# EAGLE schematic vac (EAGLE 8.5.1)
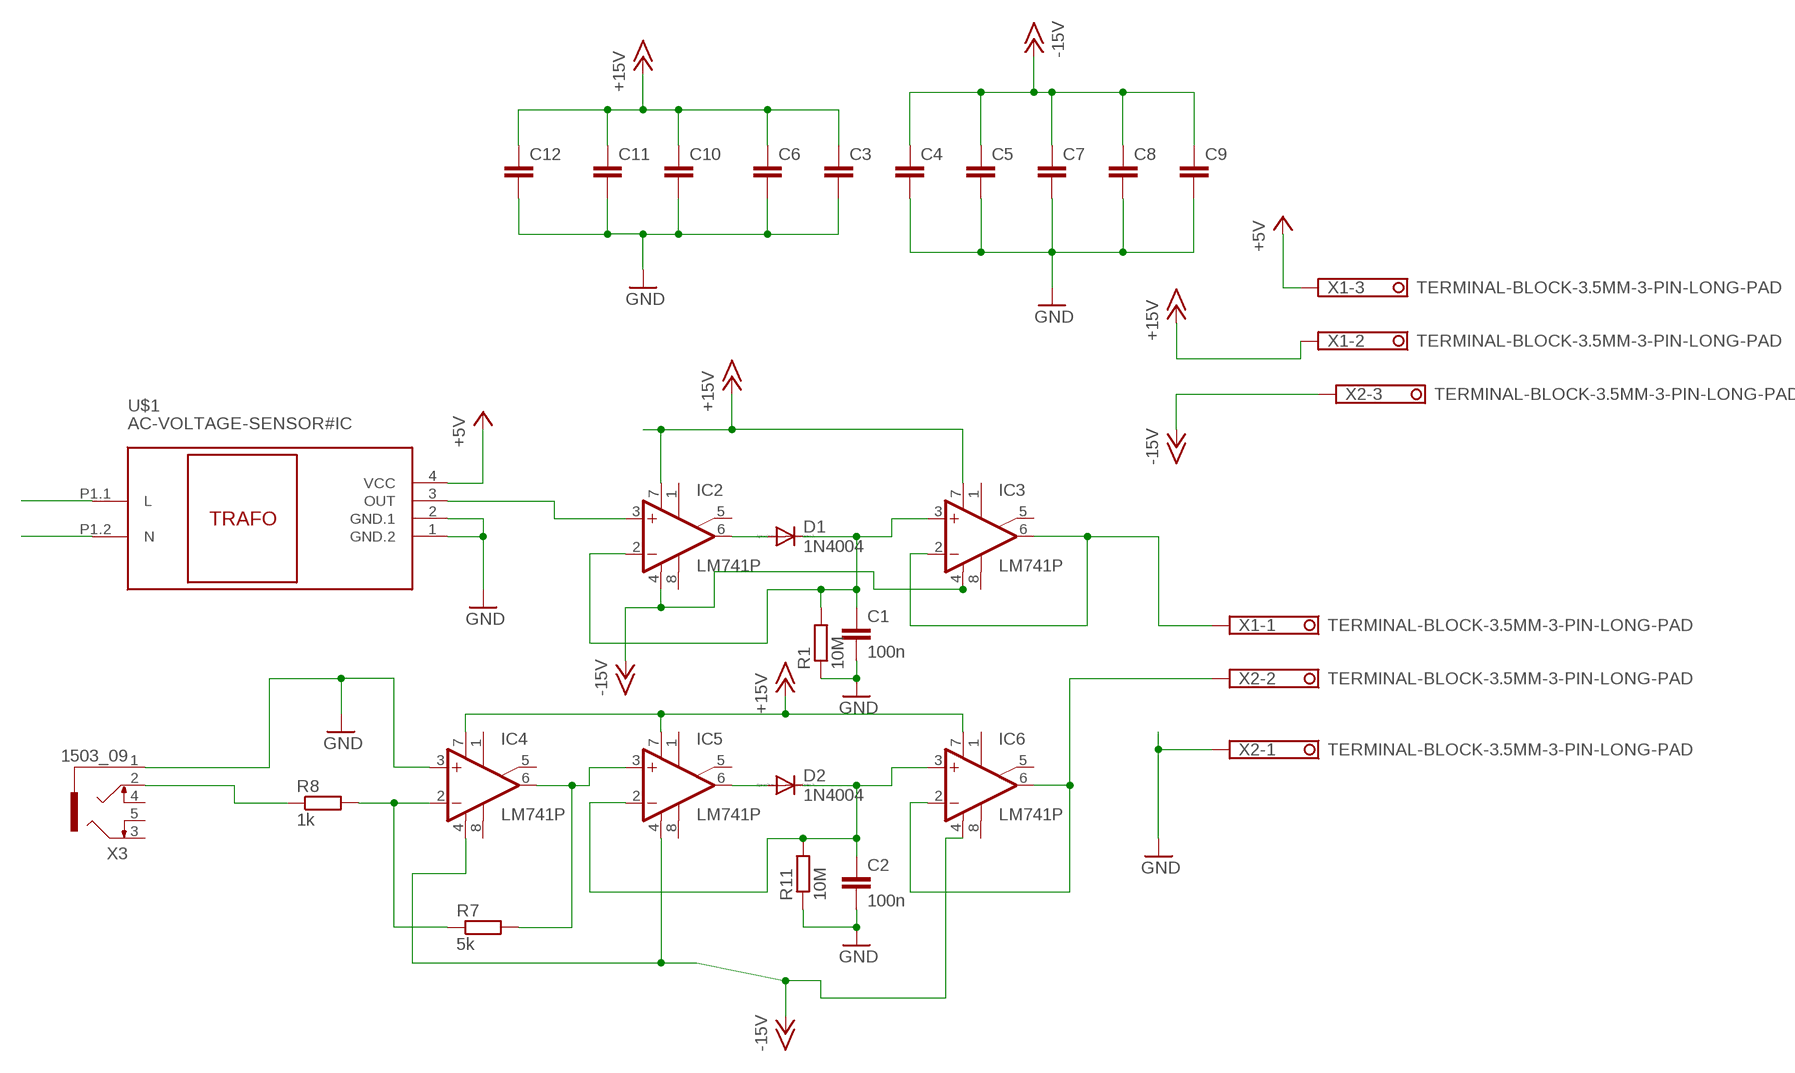
[diagram p0: schematic, sheet 1]

## Parts
C1  100n  C7.5/5  [C7.5B5]
C2  100n  C7.5/5  [C7.5B5]
C3  C-EU050-030X075  [C050-030X075]
C4  C-EU050-030X075  [C050-030X075]
C5  C-EU050-030X075  [C050-030X075]
C6  C-EU050-030X075  [C050-030X075]
C7  C-EU050-030X075  [C050-030X075]
C8  C-EU050-030X075  [C050-030X075]
C9  C-EU050-030X075  [C050-030X075]
C10  C-EU050-030X075  [C050-030X075]
C11  C-EU050-030X075  [C050-030X075]
C12  C-EU050-030X075  [C050-030X075]
D1  1N4004  [DO41-10]
D2  1N4004  [DO41-10]
IC2  LM741P  [DIL08]
IC3  LM741P  [DIL08]
IC4  LM741P  [DIL08]
IC5  LM741P  [DIL08]
IC6  LM741P  [DIL08]
R1  10M  R-EU_0207/10  [0207/10]
R7  5k  R-EU_0207/10  [0207/10]
R8  1k  R-EU_0207/10  [0207/10]
R11  10M  R-EU_0207/10  [0207/10]
U$1  AC-VOLTAGE-SENSOR#IC  [AC-VOLTAGE-SENSOR#IC]
X1  TERMINAL-BLOCK-3.5MM-3-PIN-LONG-PAD  [TERMINAL-BLOCK-3-PIN-3.5MM-LONG-PAD]
X2  TERMINAL-BLOCK-3.5MM-3-PIN-LONG-PAD  [TERMINAL-BLOCK-3-PIN-3.5MM-LONG-PAD]
X3  1503_09  [1503_09]

## Nets
+5V: U$1.4(VCC) X1.3
+15V: C3.1 C6.1 C10.1 C11.1 C12.1 IC2.7(V+) IC3.7(V+) IC4.7(V+) IC5.7(V+) IC6.7(V+) X1.2
-15V: C4.1 C5.1 C7.1 C8.1 C9.1 IC2.4(V-) IC3.4(V-) IC4.4(V-) IC5.4(V-) IC6.4(V-) X2.3
GND: C1.2 C2.2 C3.2 C4.2 C5.2 C6.2 C7.2 C8.2 C9.2 C10.2 C11.2 C12.2 IC4.3(+IN) R1.1 R11.1 U$1.1(GND.2) U$1.2(GND.1) X2.1 X3.1
IAC: IC6.2(-IN) IC6.6(OUT) X2.2
L: U$1.P1.1(L)
N: U$1.P1.2(N)
N$1: D1.A IC2.6(OUT)
N$2: D2.A IC5.6(OUT)
N$3: C1.1 D1.C IC2.2(-IN) IC3.3(+IN) R1.2
N$4: C2.1 D2.C IC5.2(-IN) IC6.3(+IN) R11.2
N$6: R8.1 X3.2
N$7: IC4.6(OUT) IC5.3(+IN) R7.2
N$17: IC4.2(-IN) R7.1 R8.2
N$20: IC2.3(+IN) U$1.3(OUT)
VAC: IC3.2(-IN) IC3.6(OUT) X1.1
Unconnected: IC2.1(ON1) IC2.5(ON2) IC2.8(OPT) IC3.1(ON1) IC3.5(ON2) IC3.8(OPT) IC4.1(ON1) IC4.5(ON2) IC4.8(OPT) IC5.1(ON1) IC5.5(ON2) IC5.8(OPT) IC6.1(ON1) IC6.5(ON2) IC6.8(OPT) X3.3 X3.4 X3.5

## Library data of the parts
C1 C2 = capacitor-wima:C: CAPACITOR naming: grid - package width
C3-C12 = rcl:C-EU: CAPACITOR, European symbol; SPICEPREFIX: C
D1 D2 = diode:1N4004: DIODE general purpose rectifier, 1 A
IC2-IC6 = linear:*741: OP AMP
R1 R7 R8 R11 = rcl:R-EU_: RESISTOR, European symbol; SPICEPREFIX: R
U$1 = diy-modules:AC-VOLTAGE-SENSOR#IC: Isolated AC Voltage Sensor based on ZMPT101B transformer Symbol with input connector ZMPT101B Voltage Transformer Operating Guide is available here: http://www.zeming-e.com/file/0_2013_10_18_093344.pdf Click here to find device on ebay.com <http://www.ebay.com/sch/arduino+voltage+transformer>
X1 X2 = Rembrandt Electronics - Terminal Block 3-5mm v1-0:TERMINAL-BLOCK-3.5MM-3-PIN: Terminal Block 3.5mm Pitch: 3,5 mm Number of pins: 3 Created by Rembrandt Electronics www.rembrandtelectronics.com
X3 = con-lumberg:1503_09: Jack connectors according to JISC 6560, 3.5 mm Klinkeneinbaukupplung nach JISC 6560, 3,5 mm, 3-polig/ stereo, abgewinkelte Ausführung, mit 2 Öffnern und Lötaugen, für Leiterplatten Rückseitenmontage Source: http://www.lumberg.com/Produkte/PDFs/1503_09.pdf; OC_FARNELL: 1243244; OC_NEWARK: unknown